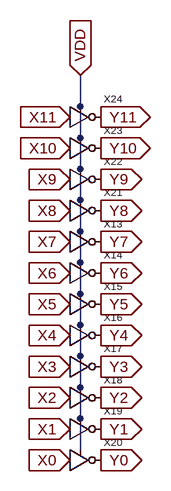
[diagram p0: schematic 12_bit_inverter.asc]
12_bit_inverter.asc, the LTspice schematic file:
Version 4
SHEET 1 1836 3644
WIRE 1696 -96 1696 -144
WIRE 1696 -48 1696 -96
WIRE 1696 0 1696 -48
WIRE 1696 48 1696 0
WIRE 1696 96 1696 48
WIRE 1696 144 1696 96
WIRE 1696 192 1696 144
WIRE 1696 240 1696 192
WIRE 1696 288 1696 240
WIRE 1696 336 1696 288
WIRE 1696 384 1696 336
WIRE 1696 432 1696 384
FLAG 1696 -144 VDD
IOPIN 1696 -144 In
FLAG 1680 64 X8
IOPIN 1680 64 In
FLAG 1728 64 Y8
IOPIN 1728 64 Out
FLAG 1680 16 X9
IOPIN 1680 16 In
FLAG 1728 16 Y9
IOPIN 1728 16 Out
FLAG 1680 -32 X10
IOPIN 1680 -32 In
FLAG 1728 -32 Y10
IOPIN 1728 -32 Out
FLAG 1680 -80 X11
IOPIN 1680 -80 In
FLAG 1728 -80 Y11
IOPIN 1728 -80 Out
FLAG 1680 448 X0
IOPIN 1680 448 In
FLAG 1728 448 Y0
IOPIN 1728 448 Out
FLAG 1680 400 X1
IOPIN 1680 400 In
FLAG 1728 400 Y1
IOPIN 1728 400 Out
FLAG 1680 352 X2
IOPIN 1680 352 In
FLAG 1728 352 Y2
IOPIN 1728 352 Out
FLAG 1680 304 X3
IOPIN 1680 304 In
FLAG 1728 304 Y3
IOPIN 1728 304 Out
FLAG 1680 256 X4
IOPIN 1680 256 In
FLAG 1728 256 Y4
IOPIN 1728 256 Out
FLAG 1680 208 X5
IOPIN 1680 208 In
FLAG 1728 208 Y5
IOPIN 1728 208 Out
FLAG 1680 160 X6
IOPIN 1680 160 In
FLAG 1728 160 Y6
IOPIN 1728 160 Out
FLAG 1680 112 X7
IOPIN 1680 112 In
FLAG 1728 112 Y7
IOPIN 1728 112 Out
SYMBOL inverter 1680 112 R0
SYMATTR InstName X13
SYMBOL inverter 1680 160 R0
SYMATTR InstName X14
SYMBOL inverter 1680 208 R0
SYMATTR InstName X15
SYMBOL inverter 1680 256 R0
SYMATTR InstName X16
SYMBOL inverter 1680 304 R0
SYMATTR InstName X17
SYMBOL inverter 1680 352 R0
SYMATTR InstName X18
SYMBOL inverter 1680 400 R0
SYMATTR InstName X19
SYMBOL inverter 1680 448 R0
SYMATTR InstName X20
SYMBOL inverter 1680 64 R0
SYMATTR InstName X21
SYMBOL inverter 1680 16 R0
SYMATTR InstName X22
SYMBOL inverter 1680 -32 R0
SYMATTR InstName X23
SYMBOL inverter 1680 -80 R0
SYMATTR InstName X24

The netlist it stands for:
* 12_bit_inverter.asc
XX13 X7 Y7 VDD inverter  ; pins In Out VDD
XX14 X6 Y6 VDD inverter  ; pins In Out VDD
XX15 X5 Y5 VDD inverter  ; pins In Out VDD
XX16 X4 Y4 VDD inverter  ; pins In Out VDD
XX17 X3 Y3 VDD inverter  ; pins In Out VDD
XX18 X2 Y2 VDD inverter  ; pins In Out VDD
XX19 X1 Y1 VDD inverter  ; pins In Out VDD
XX20 X0 Y0 VDD inverter  ; pins In Out VDD
XX21 X8 Y8 VDD inverter  ; pins In Out VDD
XX22 X9 Y9 VDD inverter  ; pins In Out VDD
XX23 X10 Y10 VDD inverter  ; pins In Out VDD
XX24 X11 Y11 VDD inverter  ; pins In Out VDD
.backanno
.end